# Altium schematic sheet CON_ETH.SchDoc: Eth connector, PoE
size 420 x 297 mm; Author: P. Zdunek; CompanyName: WUT ISE; DrawnBy: P. Zdunek; Organization: WUT ISE; Address1: PW ISE; Address2: Nowowiejska 15/19 00-665 Warsaw; Address3: p.zdunek90@gmail.com; DocumentNumber: 18; Revision: 1.0; SheetNumber: 18; SheetTotal: 37; ModifiedBy: -; CheckedDate: -; DivGrp: WUT ISE; Designer: P. Zdunek; Title2: Fast Stabilizer; ModifiedDate: -; ProjectName: Sensor Box
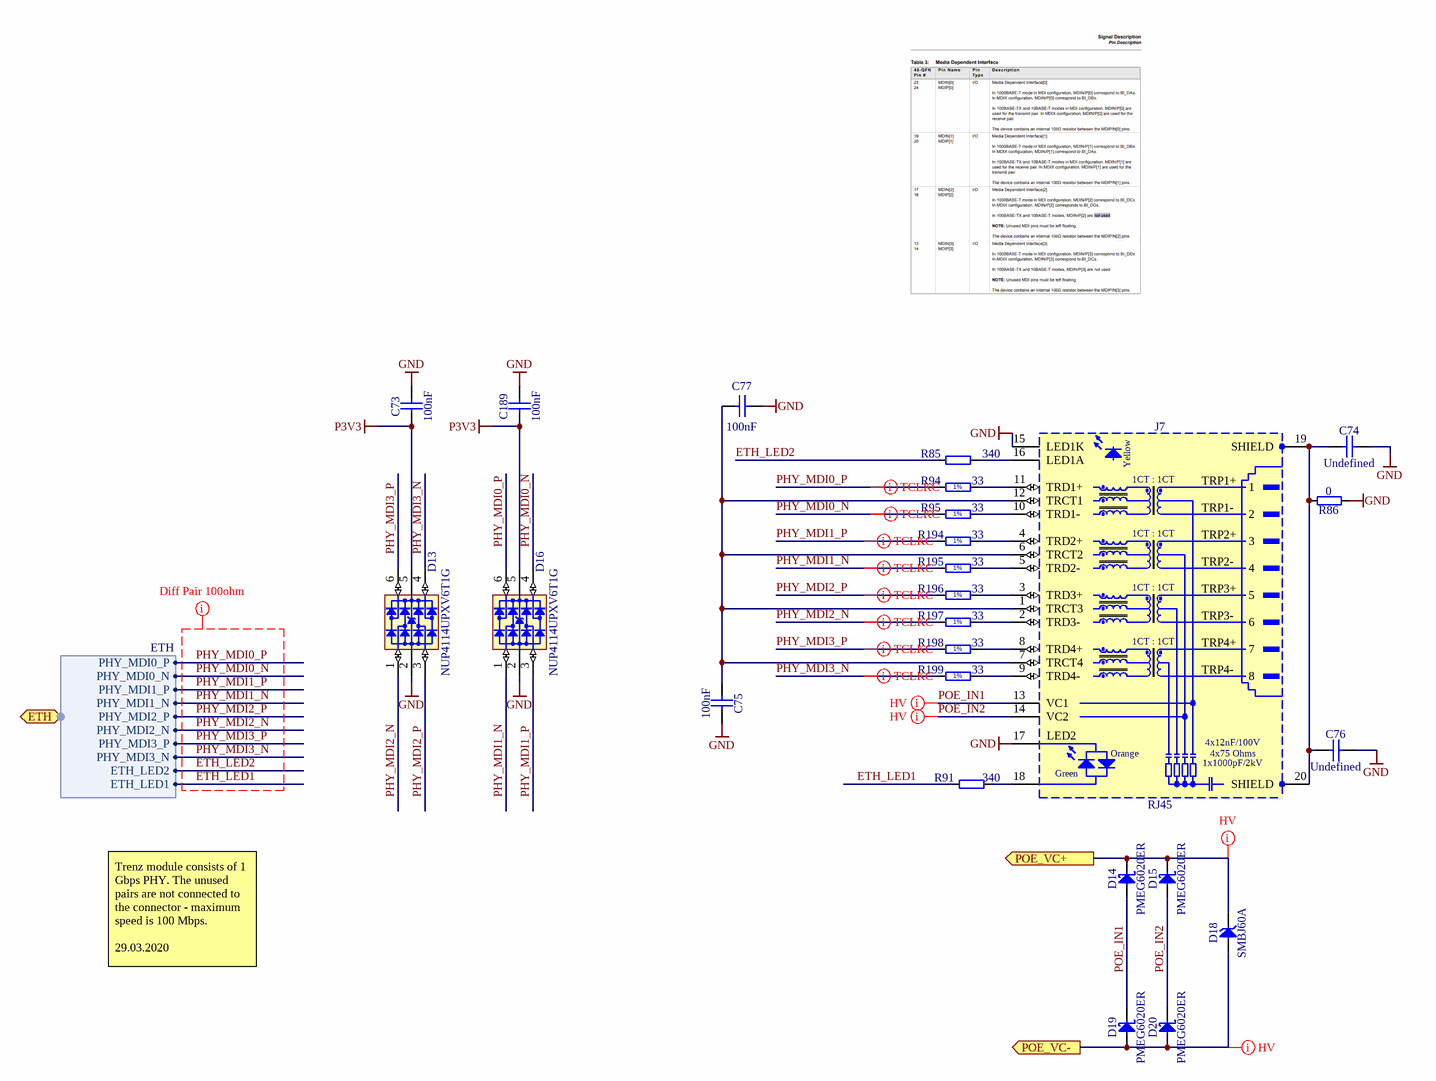
[diagram p0: CON_ETH.SchDoc]

## Parts
C73  100nF  [CAPC1005X55N]
C74  Undefined  [CAPC1608X90N]
C75  100nF  [CAPC1005X55N]
C76  Undefined  [CAPC1608X90N]
C77  100nF  [CAPC1005X55N]
C189  100nF  [CAPC1005X55N]
D13  NUP4114UPXV6T1G  [SOTFL50P160X60-6N]
D14  PMEG6020ER  [SODFL3517X110N]
D15  PMEG6020ER  [SODFL3517X110N]
D16  NUP4114UPXV6T1G  [SOTFL50P160X60-6N]
D18  SMBJ60A  [DIOM5336X265N]
D19  PMEG6020ER  [SODFL3517X110N]
D20  PMEG6020ER  [SODFL3517X110N]
J7  RJ45  [BEL_0826-1X1T-80-F]
R85  340  [RESC1608X55N]
R86  0  [RESC1005X40N]
R91  340  [RESC1608X55N]
R94  33  [RESC1005X40N]
R95  33  [RESC1005X40N]
R194  33  [RESC1005X40N]
R195  33  [RESC1005X40N]
R196  33  [RESC1005X40N]
R197  33  [RESC1005X40N]
R198  33  [RESC1005X40N]
R199  33  [RESC1005X40N]

## Ports
ETH (bidir, harness ETH), POE_VC+ (out), POE_VC- (out)

## Harnesses
ETH: PHY_MDI0_P, PHY_MDI0_N, PHY_MDI1_P, PHY_MDI1_N, PHY_MDI2_P, PHY_MDI2_N, PHY_MDI3_P, PHY_MDI3_N, ETH_LED2, ETH_LED1

## Nets
GND: C73.2 C74.2 C75.1 C76.2 C77.2 C189.2 D13.2(GND) D16.2(GND) J7.15(LED1K) J7.17(LED2) R86.1
P3V3: C73.1 C189.1 D13.5(VBUS) D16.5(VBUS)
ETH_LED1: R91.1 ; port ETH.ETH_LED1
ETH_LED2: R85.1 ; port ETH.ETH_LED2
PHY_MDI0_N: D16.4(I/O3) R95.1 ; port ETH.PHY_MDI0_N
PHY_MDI0_P: D16.6(I/O4) R94.1 ; port ETH.PHY_MDI0_P
PHY_MDI1_N: D16.1(I/O1) R195.1 ; port ETH.PHY_MDI1_N
PHY_MDI1_P: D16.3(I/O2) R194.1 ; port ETH.PHY_MDI1_P
PHY_MDI2_N: D13.1(I/O1) R197.1 ; port ETH.PHY_MDI2_N
PHY_MDI2_P: D13.3(I/O2) R196.1 ; port ETH.PHY_MDI2_P
PHY_MDI3_N: D13.4(I/O3) R199.1 ; port ETH.PHY_MDI3_N
PHY_MDI3_P: D13.6(I/O4) R198.1 ; port ETH.PHY_MDI3_P
POE_IN1: D14.2(A) D19.1(C) J7.13(VC1)
POE_IN2: D15.2(A) D20.1(C) J7.14(VC2)
POE_VC+: D14.1(C) D15.1(C) D18.1(C) ; port POE_VC+
POE_VC-: D18.2(A) D19.2(A) D20.2(A) ; port POE_VC-
NetC74_1: C74.1 C76.1 J7.19(SHIELD) J7.20(SHIELD) R86.2
NetC75_2: C75.2 C77.1 J7.1(TRCT3) J7.6(TRCT2) J7.7(TRCT4) J7.12(TRCT1)
NetJ7_2: J7.2(TRD3-) R197.2
NetJ7_3: J7.3(TRD3+) R196.2
NetJ7_4: J7.4(TRD2+) R194.2
NetJ7_5: J7.5(TRD2-) R195.2
NetJ7_8: J7.8(TRD4+) R198.2
NetJ7_9: J7.9(TRD4-) R199.2
NetJ7_10: J7.10(TRD1-) R95.2
NetJ7_11: J7.11(TRD1+) R94.2
NetJ7_16: J7.16(LED1A) R85.2
NetJ7_18: J7.18(LED2) R91.2

## Layout directives
net class HV: POE_IN1, POE_IN2, POE_VC+, POE_VC-
mark named Diff Pair 100ohm: ETH_LED1, ETH_LED2, PHY_MDI0_N, PHY_MDI0_P, PHY_MDI1_N, PHY_MDI1_P, PHY_MDI2_N, PHY_MDI2_P, PHY_MDI3_N, PHY_MDI3_P
differential pair: PHY_MDI0_N, PHY_MDI0_P, PHY_MDI1_N, PHY_MDI1_P, PHY_MDI2_N, PHY_MDI2_P, PHY_MDI3_N, PHY_MDI3_P

## Notes on the sheet
- Trenz module consists of 1 Gbps PHY. The unused pairs are not connected to the connector - maximum speed is 100 Mbps.
  29.03.2020
- Project/Equipment
- Document
- Designer
- Drawn by
- Check.by
- Copyright WUT ISE 2020.
  This documentation describes Open Hardware and is licensed under the CERN OHL v.1.2. You may redistribute and modify this documentation under the terms of the CERN OHL v.1.2. (http://ohwr.org/CERNOHL). This documentation is distributed WITHOUT ANY EXPRESS OR IMPLIED WARRANTY, INCLUDING OF MERCHANTABILITY, SATISFACTORY QUALITY AND FITNESS FOR A PARTICULAR PURPOSE. Please see the CERN OHL v.1.2 for applicable conditions.
- Contact
- File
- Last Mod.
- Print Date
- Sheet
- Size
- A3
- of
- Rev
- (in symbol BELFUSE_0826-1X1T-80-F) Yellow; 1CT : 1CT; TRP1+; TRP1-; TRP2+; TRP2-; TRP3+; TRP3-; TRP4+; TRP4-; 4x12nF/100V; Orange; 4x75 Ohms; 1x1000pF/2kV; Green
- (in symbol R0402_33R_1%_0.0625W_100PPM) 1%

## Library data of the parts
C73 C75 C77 C189 = CC0402_100NF_16V_10%_X5R: Non-polarised capacitor; Part Description: SMD Multilayer Chip Ceramic Capacitor; Manufacturer: GENERIC; Manufacturer1 Part Number: GRM155R61C104KA88D; Voltage: 16V; TC: X5R; Tolerance: ±10%; Part Number: CC0402_100NF_16V_10%_X5R; Component Kind: Standard; Component Type: Standard; Pin Count: 2; Value: 100nF; Status: None; Manufacturer Part Number: CC0402_100NF_16V_10%_X5R; Case: 0402; Mounted: Yes; Socket: No; SMD: Yes; Manufacturer1 Example: MURATA; Manufacturer1 ComponentHeight: 0.55mm; HelpURL: \\cern.ch\dfs\Applications\Altium\Datasheets\CC0402_X5R_MURATA_GRM.pdf; Author: CERN DEM JLC; Sense: No
  C73 C75 C189: CreateDate: 10.12.2013; LatestRevisionDate: 10.12.2013
  C77: CreateDate: 10/12/2013; LatestRevisionDate: 10/12/2013
C74 C76 = CC0603_NO-VALUE: Non-polarised capacitor; Part Description: Reserved Footprint For 0603(1608) Chip Ceramic Capacitor; Mounted: No; Part Number: CC0603_NO-VALUE; Component Kind: Standard; Component Type: Standard; Pin Count: 2; Value: Undefined; Status: None; Manufacturer: Undefined; Manufacturer Part Number: CC0603_NO-VALUE; Case: 0603; Socket: No; SMD: Yes; Sense: No; Manufacturer1 ComponentHeight: 0.9mm; HelpURL: Undefined; Author: CERN DEM MR; CreateDate: 22.11.2016; LatestRevisionDate: 22.11.2016
D13 D16 = NUP4114UPXV6T1G: Part Description: ESD Protection Diodes Array (8kV) with Low Clamping Voltage; Manufacturer: ON SEMICONDUCTOR; Voltage: 5.5V; PressFit: No; Bonding: No; Part Number: NUP4114UPXV6T1G; Component Kind: Standard; Component Type: Standard; Device: NUP4114UPXV6T1G; PackageDescription: SOTFL (SOT666, SOT563,), 0.50mm, Pitch; 6 Pin, 1.20mm W X 1.60mm L X 0.60mm H Body, IPC Medium Density; Manufacturer Part Number: NUP4114UPXV6T1G; Pin Count: 8; Mounted: Yes; Socket: No; SMD: Yes; Sense: No; ComponentHeight: 1.75mm; HelpURL: \\cern.ch\dfs\Applications\Altium\Datasheets\NUP4114UPXV6T1G.pdf; Author: CERN DEM JLC; CreateDate: 05.12.2012; LatestRevisionDate: 05.12.2012
D14 D15 D19 D20 = PMEG6020ER: Schottky Diode; Part Description: MEGA Schottky Barrier Rectifier; Manufacturer: NXP SEMICONDUCTORS; Voltage: 60V; Power: 2A; PressFit: No; Bonding: No; Part Number: PMEG6020ER; Component Kind: Standard; Component Type: Standard; Device: PMEG6020ER; PackageDescription: SODFL Diode (SOD123W); 2.60mm W X 1.70mm L X 1.10mm H body, IPC Medium Density; Manufacturer Part Number: PMEG6020ER; Pin Count: 2; Case: SOD-123FL; Mounted: Yes; Socket: No; SMD: Yes; Sense: No; ComponentHeight: 1.1mm; HelpURL: \\cern.ch\dfs\Applications\Altium\Datasheets\PMEG6020ER.pdf; Author: CERN DEM JMW; CreateDate: 19.06.2014; LatestRevisionDate: 19.06.2014
D18 = SMBJ60A: Zener Diode; Part Description: Uni-Directional Transient Voltage Suppressor Diode; Manufacturer: FAIRCHILD SEMICONDUCTOR; Voltage: 60V; Power: 600W; PressFit: No; Bonding: No; Part Number: SMBJ60A; Component Kind: Standard; Component Type: Standard; Device: SMBJ60A; PackageDescription: DO-214-AA/SMB Diode, Molded Body; 5.34mm L X 3.625mm W X 2.65mm H, IPC Medium Density; Manufacturer Part Number: SMBJ60A; Pin Count: 2; Case: DO-214AA; Mounted: Yes; Socket: No; SMD: Yes; Sense: No; ComponentHeight: 2.65mm; HelpURL: \\cern.ch\dfs\Applications\Altium\Datasheets\SMBJ.pdf; Author: CERN DEM JLC; CreateDate: 30.06.2008; LatestRevisionDate: 19.12.2011
J7 = BELFUSE_0826-1X1T-80-F: MagJack 1000BaseT, PoE+, 1X1, OG/Y, Tab Up, RoHS; Part Description: 1 Port, Orange Green/Yellow LEDs, RJ45 1000BaseT, PoE, Gigabit MagJack® Connector Module; Manufacturer: BEL MAGNETIC SOLUTIONS; PressFit: No; Part Number: BELFUSE_0826-1X1T-80-F; Component Kind: Standard; Component Type: Standard; Pin Count: 20; Family: RJ45; Mounted: Yes; Socket: No; SMD: No; Sense: No; Status: None; Manufacturer Part Number: 0826-1X1T-80-F; ComponentHeight: 13.61mm; HelpURL: \\cern.ch\dfs\Applications\Altium\Datasheets\BEL_0826-1X1T-80-F.pdf; Author: CERN DEM JLC; CreateDate: 30.04.2014; LatestRevisionDate: 20.09.2018
R85 R91 = R0603_340R_0.1%_0.063W_10PPM: Resistor - 0.1%; Part Description: Thin Film Chip Resistor; Manufacturer: GENERIC; Manufacturer1 Part Number: RN73C1J340RBTDF; Power: 0.063W; TC: ±10ppm; PressFit: No; Part Number: R0603_340R_0.1%_0.063W_10PPM; Component Kind: Standard; Component Type: Standard; Pin Count: 2; Value: 340; Status: Not Recommended; Tolerance: ±0.1%; Manufacturer Part Number: R0603_340R_0.1%_0.063W_10PPM; Case: 0603; Mounted: Yes; Sense: No; Socket: No; SMD: Yes; Manufacturer1 Example: TYCO HOLSWORTHY; Manufacturer1 ComponentHeight: 0.5mm; HelpURL: \\cern.ch\dfs\Applications\Altium\Datasheets\R0603_Tyco_RN73.pdf; Author: CERN DEM JLC; CreateDate: 03.12.2007; LatestRevisionDate: 13.03.2008
R86 = R0402_0R_JUMPER: Resistor; Part Description: 1A (0.05R Max DC Resistance) Zero Ohm Jumper; Manufacturer: GENERIC; Manufacturer1 Part Number: 232270591001L; PressFit: No; Part Number: R0402_0R_JUMPER; Component Kind: Standard; Component Type: Standard; Pin Count: 2; Value: 0; Status: Not Recommended; Manufacturer Part Number: R0402_0R_JUMPER; Case: 0402; Mounted: Yes; Sense: No; Socket: No; SMD: Yes; Manufacturer1 Example: YAGEO PHYCOMP; Manufacturer1 ComponentHeight: 0.4mm; HelpURL: \\cern.ch\dfs\Applications\Altium\Datasheets\R0402_Phycomp_RC0402.pdf; Author: CERN DEM JLC; CreateDate: 03/12/2007; LatestRevisionDate: 17/10/2012
R94 R95 R194-R199 = R0402_33R_1%_0.0625W_100PPM: Resistor - 1%; Part Description: General Purpose Thick Film Chip Resistor; Manufacturer: GENERIC; Manufacturer1 Part Number: 232270673309L; TC: ±100ppm/°C; PressFit: No; Part Number: R0402_33R_1%_0.0625W_100PPM; Component Kind: Standard; Component Type: Standard; Pin Count: 2; Value: 33; Status: Not Recommended; Power: 0.0625W; Tolerance: ±1%; Manufacturer Part Number: R0402_33R_1%_0.0625W_100PPM; Case: 0402; Mounted: Yes; Sense: No; Socket: No; SMD: Yes; Manufacturer1 Example: YAGEO PHYCOMP; Manufacturer1 ComponentHeight: 0.4mm; HelpURL: \\cern.ch\dfs\Applications\Altium\Datasheets\R0402_Phycomp_RC0402.pdf; Author: CERN DEM JLC; CreateDate: 03/12/2007; LatestRevisionDate: 17/10/2012